# Altium project LED Board.PrjPcb
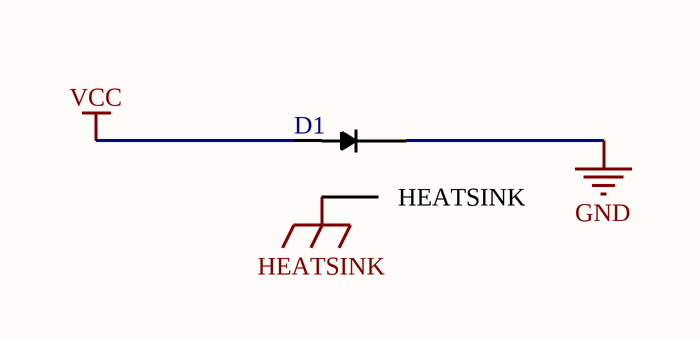
[diagram p0: LED_Board.SchDoc]
1 sheet, 1 parts. Net scope: global (net labels, ports and power ports of the same name join across sheets).
Board file: LED Board.PcbDoc

## Sheet LED_Board.SchDoc
size A

### Parts
D1  DIODE_WITH_HEATSINK  (value not drawn)

### Nets
GND: D1.1(K)
HEATSINK: D1.3(HEATSINK)
VCC: D1.2(A)